# EAGLE design tempcontrol_mount (EAGLE 5.06)
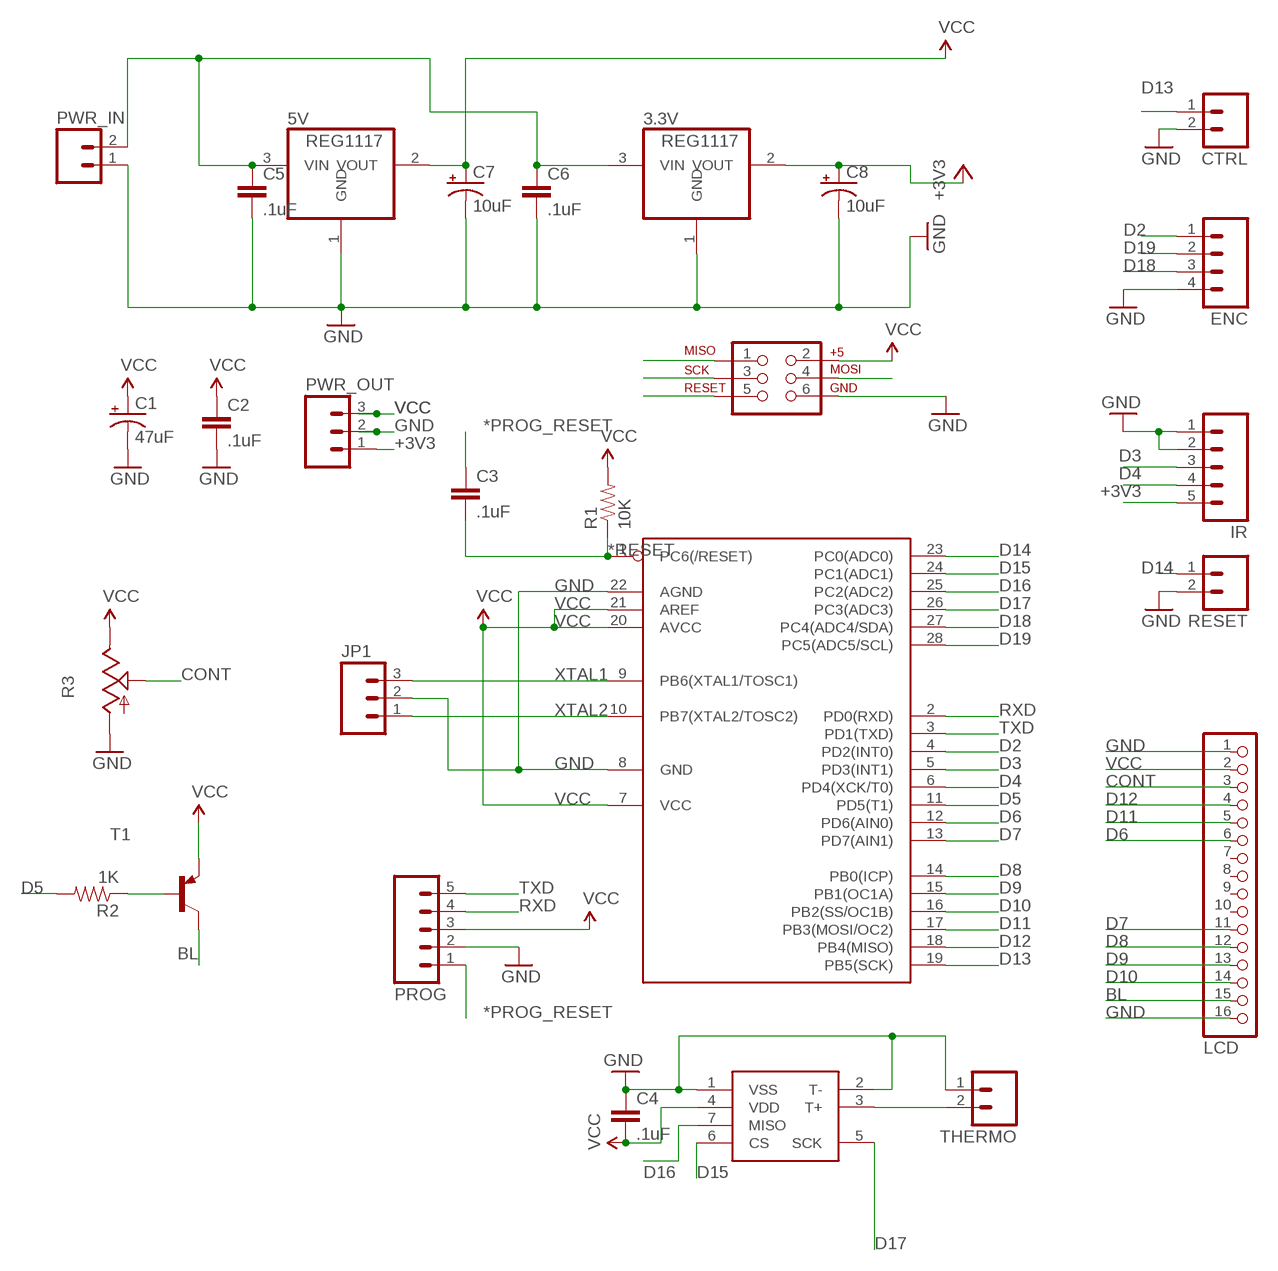
[diagram p0: schematic, sheet 1]

## Parts
3.3V  REG1117  [SOT223]
5V  REG1117  [SOT223]
C1  47uF  CAP_POLPTH2  [CPOL-RADIAL-10UF-25V]
C2  .1uF  CAP0805  [0805]
C3  .1uF  CAP0603-CAP  [0603-CAP]
C4  .1uF  CAP0805  [0805]
C5  .1uF  CAP0805  [0805]
C6  .1uF  CAP0805  [0805]
C7  10uF  CAP_POL3528  [EIA3528]
C8  10uF  CAP_POL3528  [EIA3528]
CTRL  M02LOCK  [1X02_LOCK]
ENC  M04LOCK  [1X04_LOCK]
IC1  MEGA168-P  MEGA8-P  [DIL28-3]
IR  M05LOCK  [1X05_LOCK]
JP1  M03LOCK  [1X03_LOCK]
JP7  LCD  PINHD-1X16  [1X16]
PROG  PROG  M05LOCK  [1X05_LOCK]
PWR_IN  M02LOCK  [1X02_LOCK]
PWR_OUT  M03LOCK  [1X03_LOCK]
R1  10K  RESISTOR  [0805]
R2  1K  RESISTOR  [0805]
R3  TRIM_US-B64Y  [B64Y]
RESET  M02LOCK  [1X02_LOCK]
T1  2N3906-PNP-TO92-EBC  [TO92-EBC]
THERMO  M02LOCK  [1X02_LOCK]
U$1  AVR_SPI_PRG_6NS  [2X3-NS]
U$2  MAX6675  [SO08]

## Nets
*PROG_RESET: C3.1 PROG.1
*RESET: C3.2 IC1.1(PC6(/RESET)) R1.1 U$1.5
+3V3: 3.3V.2(VOUT) C8.A(+) IR.5 PWR_OUT.1
BL: JP7.15 T1.C
CONT: JP7.3 R3.S
D2: ENC.1 IC1.4(PD2(INT0))
D3: IC1.5(PD3(INT1)) IR.3
D4: IC1.6(PD4(XCK/T0)) IR.4
D5: IC1.11(PD5(T1)) R2.2
D6: IC1.12(PD6(AIN0)) JP7.6
D7: IC1.13(PD7(AIN1)) JP7.11
D8: IC1.14(PB0(ICP)) JP7.12
D9: IC1.15(PB1(OC1A)) JP7.13
D10: IC1.16(PB2(SS/OC1B)) JP7.14
D11: IC1.17(PB3(MOSI/OC2)) JP7.5 U$1.4
D12: IC1.18(PB4(MISO)) JP7.4 U$1.1
D13: CTRL.1 IC1.19(PB5(SCK)) U$1.3
D14: IC1.23(PC0(ADC0)) RESET.1
D15: IC1.24(PC1(ADC1)) U$2.6(CS)
D16: IC1.25(PC2(ADC2)) U$2.7(MISO)
D17: IC1.26(PC3(ADC3)) U$2.5(SCK)
D18: ENC.3 IC1.27(PC4(ADC4/SDA))
D19: ENC.2 IC1.28(PC5(ADC5/SCL))
GND: 3.3V.1(GND) 5V.1(GND) C1.2(-) C2.2 C4.1 C5.2 C6.2 C7.C(-) C8.C(-) CTRL.2 ENC.4 IC1.8(GND) IC1.22(AGND) IR.1 IR.2 JP1.2 JP7.1 JP7.16 PROG.2 PWR_IN.1 PWR_OUT.2 R3.A RESET.2 THERMO.1 U$1.6 U$2.1(VSS) U$2.2(T-)
N$7: R2.1 T1.B
POS_IN: 3.3V.3(VIN) 5V.3(VIN) C5.1 C6.1 PWR_IN.2
RXD: IC1.2(PD0(RXD)) PROG.4
T+: THERMO.2 U$2.3(T+)
TXD: IC1.3(PD1(TXD)) PROG.5
VCC: 5V.2(VOUT) C1.1(+) C2.1 C4.2 C7.A(+) IC1.7(VCC) IC1.20(AVCC) IC1.21(AREF) JP7.2 PROG.3 PWR_OUT.3 R1.2 R3.E T1.E U$1.2 U$2.4(VDD)
XTAL1: IC1.9(PB6(XTAL1/TOSC1)) JP1.3
XTAL2: IC1.10(PB7(XTAL2/TOSC2)) JP1.1
Unconnected: JP7.7 JP7.8 JP7.9 JP7.10

## Library data of the parts
3.3V 5V = mylib:REG1117: 800mA and 1A Low Dropout (LDO) Positive Regulator 1.8V, 2.5V, 2.85V, 3.3V, 5V, and Adj
C1 C7 C8 = SparkFun:CAP_POL: Capacitor Polarized These are standard SMD and PTH capacitors. Normally 10uF, 47uF, and 100uF in electrolytic and tantalum varieties. Always verify the external diameter of the through hole cap, it varies with capacity, voltage, and manufacturer. The EIA devices should be standard.
C2-C6 = SparkFun:CAP: Capacitor Standard 0603 ceramic capacitor, and 0.1" leaded capacitor.
CTRL PWR_IN RESET THERMO = SparkFun:M02: Header 2 Standard 2-pin 0.1" header. Use with straight break away headers (SKU : PRT-00116), right angle break away headers (PRT-00553), swiss pins (PRT-00743), machine pins (PRT-00117), and female headers (PRT-00115). Molex polarized connector foot print use with SKU : PRT-08233 with associated crimp pins and housings.
ENC = SparkFun:M04: Header 4 Standard 4-pin 0.1" header. Use with straight break away headers (SKU : PRT-00116), right angle break away headers (PRT-00553), swiss pins (PRT-00743), machine pins (PRT-00117), and female headers (PRT-00115). Molex polarized connector foot print use with SKU : PRT-08231 with associated crimp pins and housings.
IC1 = atmel1:MEGA8-P: MICROCONTROLLER 8 Kbytes FLASH 1 kbytes SRAM 512 bytes EEPROM USART 4-channel 10 bit ADC 2-channel 8 bit ADC
IR PROG = SparkFun:M05: Header 5 Standard 5-pin 0.1" header. Use with straight break away headers (SKU : PRT-00116), right angle break away headers (PRT-00553), swiss pins (PRT-00743), machine pins (PRT-00117), and female headers (PRT-00115). Molex polarized connector foot print use with SKU : PRT-08230 with associated crimp pins and housings.
JP1 PWR_OUT = SparkFun:M03: Header 3 Standard 3-pin 0.1" header. Use with straight break away headers (SKU : PRT-00116), right angle break away headers (PRT-00553), swiss pins (PRT-00743), machine pins (PRT-00117), and female headers (PRT-00115). Molex polarized connector foot print use with SKU : PRT-08232 with associated crimp pins and housings.
JP7 = pinhead:PINHD-1X16: PIN HEADER
R1 R2 = SparkFun:RESISTOR: Resistor Basic schematic elements and footprints for 0603, 1206, and PTH 1/10th watt (small) resistors.
R3 = pot:TRIM_US-: POTENTIOMETER
T1 = transistor-neu-to92:*-PNP-: PNP Transistror
U$1 = SparkFun:AVR_SPI_PRG_6: AVR ISP 6 Pin This is the reduced ISP connector for AVR programming. Common on Arduino. This footprint will take up less PCB space and can be used with a 10-pin to 6-pin adapter such as SKU: BOB-08508
U$2 = max6675:MAX6675

## Board
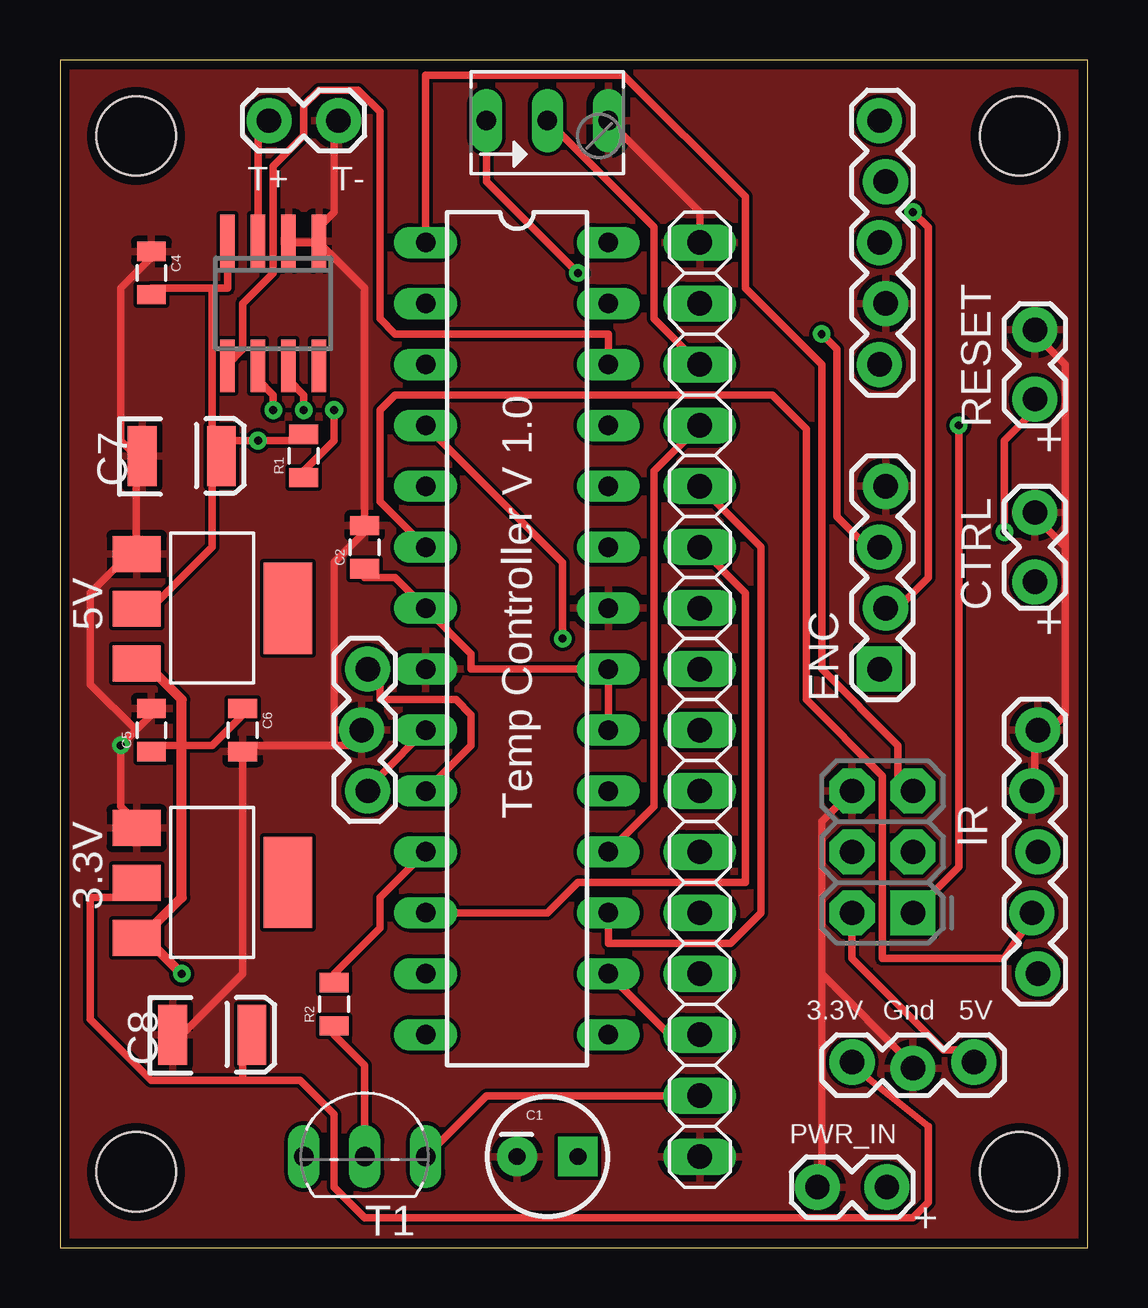
[diagram p1: board, top side]
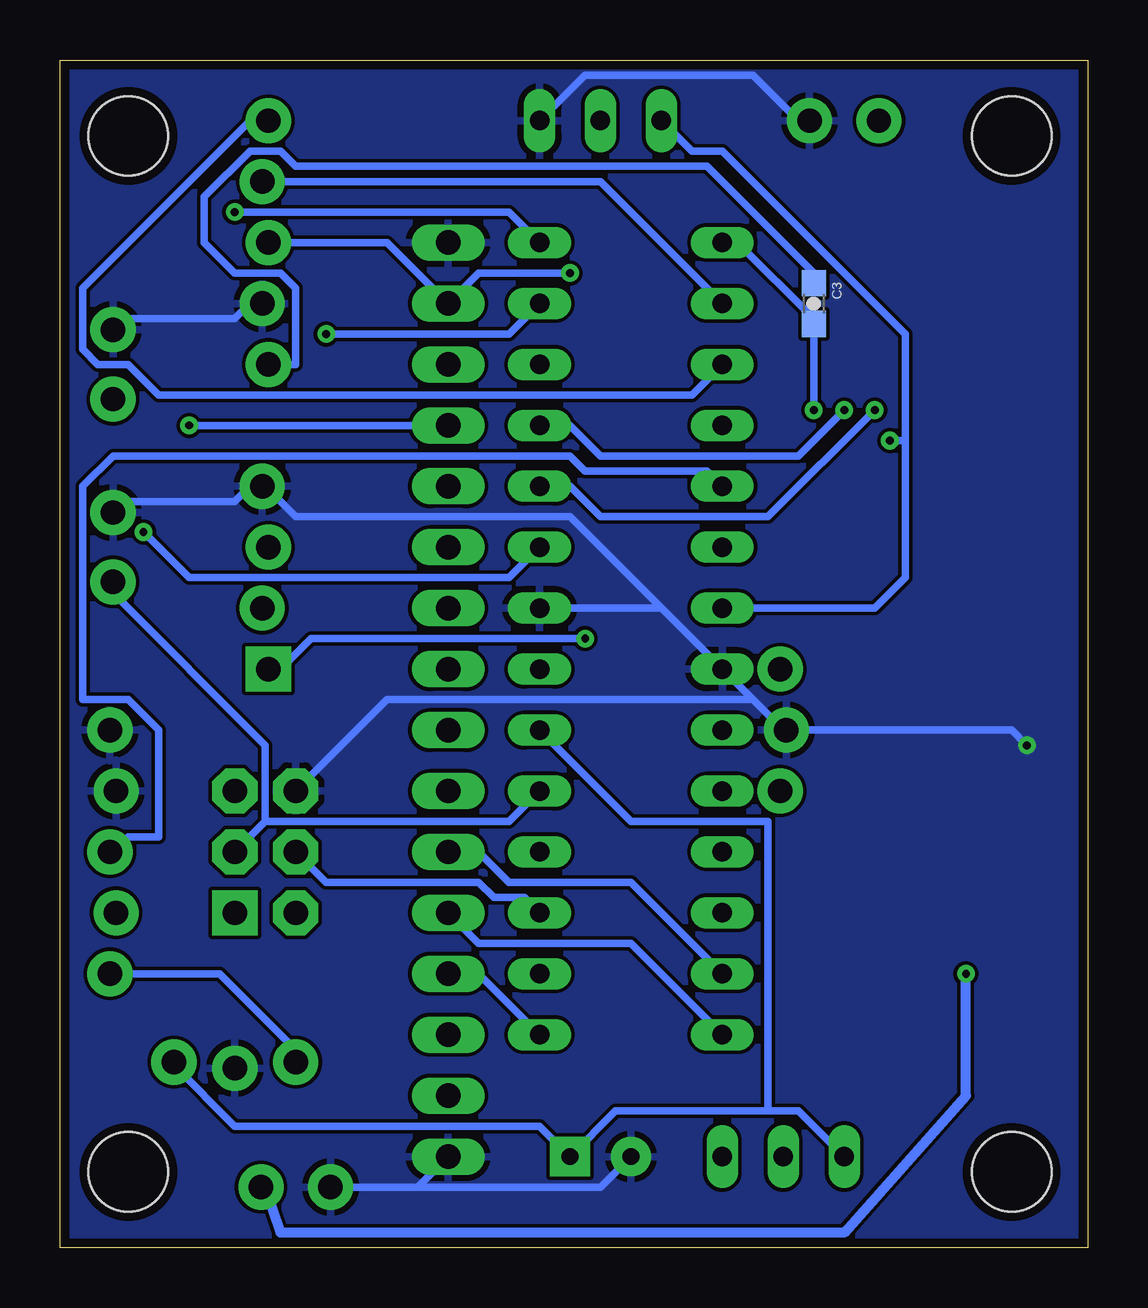
[diagram p2: board, bottom side, seen from below]

Size 42.85 x 49.52 mm. Coordinates in mm from the lower left corner, seen from the top.
Outline: 42.85,0 42.85,49.52 0,49.52 0,0 42.85,0
Copper layers (1*16): Top 0.0356mm / dielectric 1.5011mm / Bottom 0.0356mm
Design rules "LaenPCBOrder *": minimum track width 12mil, minimum drill 13mil, track to track 6mil, track to pad 6mil, pad to pad 6mil, via to via 6mil, smd to smd 6mil, copper to edge 15mil, drill to drill 6mil, minimum pad ring 10mil, minimum via ring 8mil, stop-mask expansion 4mil, vias tented up to drill 0mil, thermal gap 10mil

### Footprints (pad centres in the part's own frame; a part is rotated, then mirrored left to right if it is on the bottom)
SOT223 = smd 1.499 x 2.007: 1 -2.261,-3.15; 2 0.025,-3.15; 3 2.311,-3.15 | smd 3.81 x 2.007: 4 0,3.15
CPOL-RADIAL-10UF-25V = drill 0.7 pad 1.651 square: 1 1.27,0 | drill 0.7 pad 1.651 round: 2 -1.27,0
0805 = smd 0.8 x 1.2: 1 -0.9,0; 2 0.9,0
0603-CAP = smd 1.1 x 1: 1 -0.85,0; 2 0.85,0
EIA3528 = smd 1.2 x 2.5: A 1.65,0; C -1.65,0
1X02_LOCK = drill 1.016 pad 1.88 round: 1 -0.178,0; 2 2.718,0
1X04_LOCK = drill 1.016 pad 1.88 square: 1 0,0.127 | drill 1.016 pad 1.88 round: 2 2.54,-0.127; 3 5.08,0.127; 4 7.62,-0.127
DIL28-3 = drill 0.813 long: 1 -16.51,-3.81; 2 -13.97,-3.81; 3 -11.43,-3.81; 4 -8.89,-3.81; 5 -6.35,-3.81; 6 -3.81,-3.81; 7 -1.27,-3.81; 8 1.27,-3.81; 9 3.81,-3.81; 10 6.35,-3.81; 11 8.89,-3.81; 12 11.43,-3.81; 13 13.97,-3.81; 14 16.51,-3.81; 15 16.51,3.81; 16 13.97,3.81; 17 11.43,3.81; 18 8.89,3.81; 19 6.35,3.81; 20 3.81,3.81; 21 1.27,3.81; 22 -1.27,3.81; 23 -3.81,3.81; 24 -6.35,3.81; 25 -8.89,3.81; 26 -11.43,3.81; 27 -13.97,3.81; 28 -16.51,3.81
1X05_LOCK = drill 1.016 pad 1.88 round: 1 0,0.127; 2 2.54,-0.127; 3 5.08,0.127; 4 7.62,-0.127; 5 10.16,0.127
1X03_LOCK = drill 1.016 pad 1.88 round: 1 0,0.127; 2 2.54,-0.127; 3 5.08,0.127
1X16 = drill 1.016 long: 1 -19.05,0; 2 -16.51,0; 3 -13.97,0; 4 -11.43,0; 5 -8.89,0; 6 -6.35,0; 7 -3.81,0; 8 -1.27,0; 9 1.27,0; 10 3.81,0; 11 6.35,0; 12 8.89,0; 13 11.43,0; 14 13.97,0; 15 16.51,0; 16 19.05,0
B64Y = drill 0.813 long: A 2.54,0; E -2.54,0; S 0,0
TO92-EBC = drill 0.813 long: B 0,-1.27; C 2.54,-1.27; E -2.54,-1.27
2X3-NS = drill 1.016 pad 1.88 square: 1 -2.54,-1.27 | drill 1.016 pad 1.88 octagon: 2 -2.54,1.27; 3 0,-1.27; 4 0,1.27; 5 2.54,-1.27; 6 2.54,1.27
SO08 = smd 0.6 x 2.2: 1 -1.905,-2.6; 2 -0.635,-2.6; 3 0.635,-2.6; 4 1.905,-2.6; 5 1.905,2.6; 6 0.635,2.6; 7 -0.635,2.6; 8 -1.905,2.6
STAND-OFF = hole 3.302: 0,0

### Placement (x,y rotation side)
3.3V  6.35,15.24 270 top
5V  6.35,26.67 270 top
C1  20.32,3.81 0 top
C2  12.7,29.21 90 top
C3  11.43,39.37 270 bottom
C4  3.81,40.64 270 top
C5  3.81,21.59 90 top
C6  7.62,21.59 270 top
C7  5.08,33.02 0 top
C8  6.35,8.89 0 top
CTRL  40.64,27.94 90 top
ENC  34.29,24.13 90 top
IC1  19.05,25.4 270 top
IR  40.64,21.59 270 top
JP1  12.7,24.13 270 top
JP7  26.67,22.86 270 top
PROG  34.29,36.83 90 top
PWR_IN  31.75,2.54 0 top
PWR_OUT  33.02,7.62 0 top
R1  10.16,33.02 90 top
R2  11.43,10.16 90 top
R3  20.32,46.99 0 top
RESET  40.64,35.56 90 top
T1  12.7,5.08 0 top
THERMO  11.43,46.99 180 top
U$1  34.29,16.51 90 top
U$2  8.89,39.37 180 top
U$3  [STAND-OFF]  40,46.35 0 top
U$4  [STAND-OFF]  40,3.18 0 top
U$5  [STAND-OFF]  3.18,3.18 0 top
U$6  [STAND-OFF]  3.18,46.35 0 top

### Tracks (layer width: path | path; a pad name or v marks a point on that pad's centre or on a via)
*PROG_RESET
  Bottom 0.305: C3.1 11.43,40.64 15.88,45.09 33.02,45.09 33.65,45.72 34.92,45.72 36.83,43.81 36.83,41.91 35.56,40.64 33.65,40.64 33.02,40 33.02,36.83 PROG.1
*RESET  (via drill 0.33)
  Top 0.305: v11.43,34.92 11.43,33.66 10.16,32.38 R1.1 | U$1.5 34.92,19.69 34.92,20.95 31.75,24.13 31.75,36.83 28.57,40 28.57,43.81 23.5,48.89 15.24,48.89 IC1.1
  Bottom 0.305: IC1.1 14.61,41.91 11.43,38.73 C3.2 v11.43,34.92
+3V3
  Top 0.305: 7.62,6.99 3.81,6.99 1.27,9.53 1.27,14.6 3.18,14.6 3.3V.2 | 7.62,6.99 7.62,8.89 C8.A | 7.62,6.99 10.01,6.99 11.43,5.56 11.43,2.54 12.7,1.27 35.56,1.27 36.2,1.91 36.2,5.08 33.02,7.62 PWR_OUT.1
  Bottom 0.305: PWR_OUT.1 33.02,8.26 36.2,11.43 IR.5
BL
  Top 0.305: T1.C 17.78,6.35 JP7.15
CONT
  Top 0.305: R3.S 24.77,42.55 24.77,38.73 JP7.3
D2  (via drill 0.33)
  Top 0.305: IC1.4 20.96,28.57 v20.96,25.4
  Bottom 0.305: v20.96,25.4 32.38,25.4 33.65,24.13 ENC.1
D3
  Bottom 0.305: IC1.5 15.88,32.38 20.96,32.38 21.59,33.02 40.64,33.02 41.91,31.75 41.91,22.86 40,22.86 38.73,21.59 38.73,17.15 40,17.15 40.64,16.51 IR.3
D4
  Top 0.305: IC1.6 13.34,31.12 13.34,34.92 13.97,35.56 29.7,35.56 31.11,34.14 31.11,22.86 34.29,19.69 34.29,12.06 39.37,12.06 40.64,13.97 IR.4
D5
  Top 0.305: IC1.11 13.34,14.6 13.34,13.33 11.43,11.43 R2.2
D6
  Top 0.305: JP7.6 28.57,27.3 28.57,15.24 21.59,15.24 20.32,13.97 IC1.12
D7
  Bottom 0.305: IC1.13 19.05,15.24 24.13,15.24 25.4,16.51 JP7.11
D8
  Bottom 0.305: IC1.14 19.05,12.7 25.4,12.7 JP7.12
D9
  Bottom 0.305: IC1.15 25.4,11.43 JP7.13
D10
  Top 0.305: IC1.16 25.4,8.89 JP7.14
D11
  Top 0.305: JP7.5 29.21,29.21 29.21,13.97 27.94,12.7 22.86,12.7 IC1.17
  Bottom 0.305: IC1.17 23.5,14.6 24.77,14.6 25.4,15.24 31.75,15.24 U$1.4
D12  (via drill 0.33)
  Top 0.305: IC1.18 24.77,18.41 24.77,32.38 JP7.4 | U$1.1 37.46,15.88 v37.46,34.29
  Bottom 0.305: JP7.4 v37.46,34.29
D13
  Bottom 0.305: IC1.19 24.13,17.78 34.29,17.78 | 34.29,17.78 U$1.3 | 34.29,17.78 34.29,20.95 40.64,27.3 CTRL.1
D14  (via drill 0.33)
  Top 0.305: v39.37,29.84 39.37,33.66 40.64,34.92 RESET.1
  Bottom 0.305: IC1.23 24.13,27.94 37.46,27.94 v39.37,29.84
D15  (via drill 0.33)
  Top 0.305: v8.89,34.92 8.89,35.56 8.26,36.2 U$2.6
  Bottom 0.305: v8.89,34.92 13.34,30.48 20.32,30.48 21.59,31.75 IC1.24
D16  (via drill 0.33)
  Top 0.305: v10.16,34.92 10.16,35.56 9.53,36.2 U$2.7
  Bottom 0.305: v10.16,34.92 12.07,33.02 20.32,33.02 21.59,34.29 IC1.25
D17
  Top 0.305: IC1.26 22.86,38.1 13.97,38.1 13.34,38.73 13.34,47.36 12.44,48.26 10.79,48.26 10.16,47.62 10.16,46.35 8.89,45.09 8.89,40.64 7.62,39.37 7.62,37.46 6.99,36.83 U$2.5
D18  (via drill 0.33)
  Top 0.305: v31.75,38.1 32.38,37.46 32.38,30.48 33.65,29.21 ENC.3
  Bottom 0.305: IC1.27 24.13,38.1 v31.75,38.1
D19  (via drill 0.33)
  Top 0.305: v35.56,43.18 36.2,42.55 36.2,27.94 34.92,26.67 ENC.2
  Bottom 0.305: IC1.28 24.13,43.18 v35.56,43.18
GND  (via drill 0.33)
  Top 0.305: U$1.6 31.75,17.78 31.75,11.43 | 31.75,11.43 31.75,2.54 PWR_IN.1 | 31.75,11.43 35.56,7.62 PWR_OUT.2 | IR.2 40.64,19.05 40.64,21.59 IR.1 41.27,21.59 41.91,22.23 41.91,29.21 | 41.91,29.21 40.64,30.48 CTRL.2 | 41.91,29.21 41.91,36.83 40.64,38.1 RESET.2 | 3.18,21.59 v2.54,20.95 2.54,18.41 3.18,17.78 3.3V.1 | 3.18,21.59 3.81,22.23 C5.2 | 3.18,33.02 2.54,33.66 2.54,40 3.81,41.27 C4.1 | 3.18,29.21 3.18,33.02 | 3.18,33.02 C7.C | 3.18,21.59 1.27,23.49 1.27,27.3 3.18,29.21 | 3.18,29.21 5V.1 | R3.A 26.67,43.18 JP7.1 | 10.79,41.91 9.53,41.91 U$2.2 | THERMO.1 11.43,46.99 11.43,43.18 10.79,42.55 U$2.1 10.79,41.91 | 11.43,20.95 12.07,20.95 12.07,21.59 JP1.2 | 11.43,20.95 7.62,20.95 C6.2 7.62,11.43 5.08,8.89 C8.C | 11.43,20.95 11.43,28.57 12.7,29.84 C2.2 12.7,40 10.79,41.91
  Bottom 0.305: 27.94,2.54 JP7.16 | PWR_IN.1 27.94,2.54 | C1.2 20.32,2.54 27.94,2.54 | PROG.2 34.92,39.37 35.56,38.73 40.64,38.73 RESET.2 | CTRL.2 40.64,31.12 35.56,31.12 34.92,31.75 ENC.4 34.29,31.75 33.02,30.48 21.59,30.48 17.78,26.67 | 13.97,22.86 12.7,21.59 JP1.2 3.18,21.59 v2.54,20.95 | 13.97,22.86 IC1.8 17.78,26.67 | 17.78,26.67 IC1.22 | R3.A 20.96,48.89 13.97,48.89 12.07,46.99 THERMO.1 | U$1.6 29.21,22.86 13.97,22.86
  pour Top: 0,49.53 43.18,49.53 43.18,0 0,0
  pour Bottom: 0,49.53 43.18,49.53 43.18,0 0,0 0,1.27
N$7
  Top 0.305: T1.B 12.7,7.62 11.43,8.89 R2.1
POS_IN  (via drill 0.33)
  Top 0.305: C5.1 3.81,20.95 5.08,20.95 6.35,20.95 7.62,22.23 C6.1 | 3.81,13.33 3.3V.3 3.81,12.7 | 3.81,24.13 5V.3
  Top 0.406: 3.81,13.33 5.08,14.6 5.08,20.95 5.08,22.86 3.81,24.13 | v5.08,11.43 3.81,12.7
  Bottom 0.305: 34.29,2.54 PWR_IN.2
  Bottom 0.406: 34.29,2.54 33.65,0.64 10.16,0.64 5.08,6.35 v5.08,11.43
RXD
  Bottom 0.305: IC1.2 20.32,44.45 PROG.4
T+
  Top 0.305: U$2.3 8.26,46.53 THERMO.2
TXD
  Bottom 0.305: IC1.3 16.51,35.56 38.73,35.56 40,36.83 41.27,36.83 41.91,37.46 41.91,40 34.92,46.99 PROG.5
VCC  (via drill 0.33)
  Top 0.305: U$1.2 33.02,12.06 36.83,8.26 38.1,8.26 PWR_OUT.3 | 6.35,40 6.99,40 U$2.4 | 6.35,40 3.81,40 C4.2 | R1.2 10.16,33.66 v8.26,33.66 6.99,33.66 6.99,33.02 C7.A 6.35,33.02 | 6.35,33.02 6.35,29.21 3.81,26.67 5V.2 | 6.35,33.02 6.35,40 | IC1.20 IC1.21 17.14,24.13 17.14,24.77 IC1.7 13.97,27.94 12.7,27.94 C2.1 | v21.59,40.64 17.78,44.45 R3.E
  Bottom 0.305: T1.E 12.07,5.71 13.34,5.71 | 13.34,5.71 19.68,5.71 C1.1 22.86,5.08 35.56,5.08 38.1,7.62 PWR_OUT.3 | PROG.3 29.21,41.91 JP7.2 25.4,40.64 v21.59,40.64 | R3.E 16.51,45.72 15.24,45.72 7.62,38.1 7.62,33.66 | IC1.7 8.89,26.67 7.62,27.94 7.62,33.66 | 7.62,33.66 v8.26,33.66 | 13.34,5.71 13.34,17.78 19.05,17.78 IC1.20
XTAL1
  Top 0.305: IC1.9 13.34,19.69 13.34,19.05 JP1.3
XTAL2
  Top 0.305: IC1.10 17.14,20.95 17.14,22.23 16.51,22.86 13.34,22.86 13.34,24.13 JP1.1

### Text on the board
tNames: T+ | T- | Temp Controller V 1.0 | + | + | 3.3V | Gnd | 5V | +